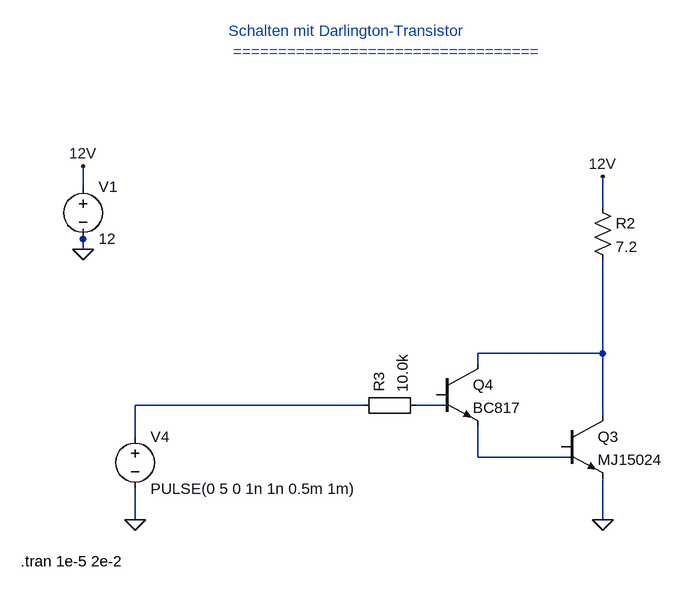
[diagram p0: schematic 3_3_1_Schalten_mit_Darlington.asc]
3_3_1_Schalten_mit_Darlington.asc, the LTspice schematic file:
Version 4
SHEET 1 880 680
WIRE 896 784 912 784
WIRE 912 784 912 800
WIRE 960 832 960 864
WIRE 960 496 960 512
WIRE 160 464 160 448
WIRE 704 704 720 704
WIRE 720 704 720 720
WIRE 768 752 768 784
WIRE 240 848 240 864
WIRE 960 512 960 640
WIRE 960 864 960 896
WIRE 160 480 160 448
WIRE 160 384 160 352
WIRE 960 368 960 416
WIRE 960 640 960 736
WIRE 768 656 768 640
WIRE 768 640 960 640
WIRE 768 784 768 800
WIRE 768 800 912 800
WIRE 720 720 672 720
WIRE 240 768 240 720
WIRE 240 720 592 720
WIRE 240 864 240 896
FLAG 960 896 0
FLAG 160 480 0
FLAG 240 896 0
FLAG 960 896 0
FLAG 160 480 0
FLAG 240 896 0
FLAG 160 352 12V
FLAG 960 368 12V
SYMBOL npn 896 736 R0
SYMATTR InstName Q3
SYMATTR Value MJ15024
SYMBOL res 944 400 R0
SYMATTR InstName R2
SYMATTR Value 7.2
SYMBOL Misc\EuropeanResistor 576 736 R270
SYMATTR InstName R3
SYMATTR Value 10.0k
SYMBOL voltage 160 368 R0
SYMATTR InstName V1
SYMATTR Value 12
SYMBOL npn 704 656 R0
SYMATTR InstName Q4
SYMATTR Value BC817
SYMBOL voltage 240 752 R0
SYMATTR InstName V4
SYMATTR Value PULSE(0 5 0 1n 1n 0.5m 1m)
TEXT 64 960 Left 2 !.tran 1e-5 2e-2
TEXT 384 144 Left 2 ;Schalten mit Darlington-Transistor \n ==================================

The netlist it stands for:
* 3_3_1_Schalten_mit_Darlington.asc
Q3 N002 N001 0 0 MJ15024
R2 12V N002 7.2
R3 N004 N003 10.0k
V1 12V 0 12
Q4 N002 N003 N001 0 BC817
V4 N004 0 PULSE(0 5 0 1n 1n 0.5m 1m)
.model NPN NPN
.model PNP PNP
.lib standard.bjt
.tran 1e-5 2e-2
* Schalten mit Darlington-Transistor
*  ==================================
.backanno
.end